# EAGLE design BengalaV1 (EAGLE 9.6.2)
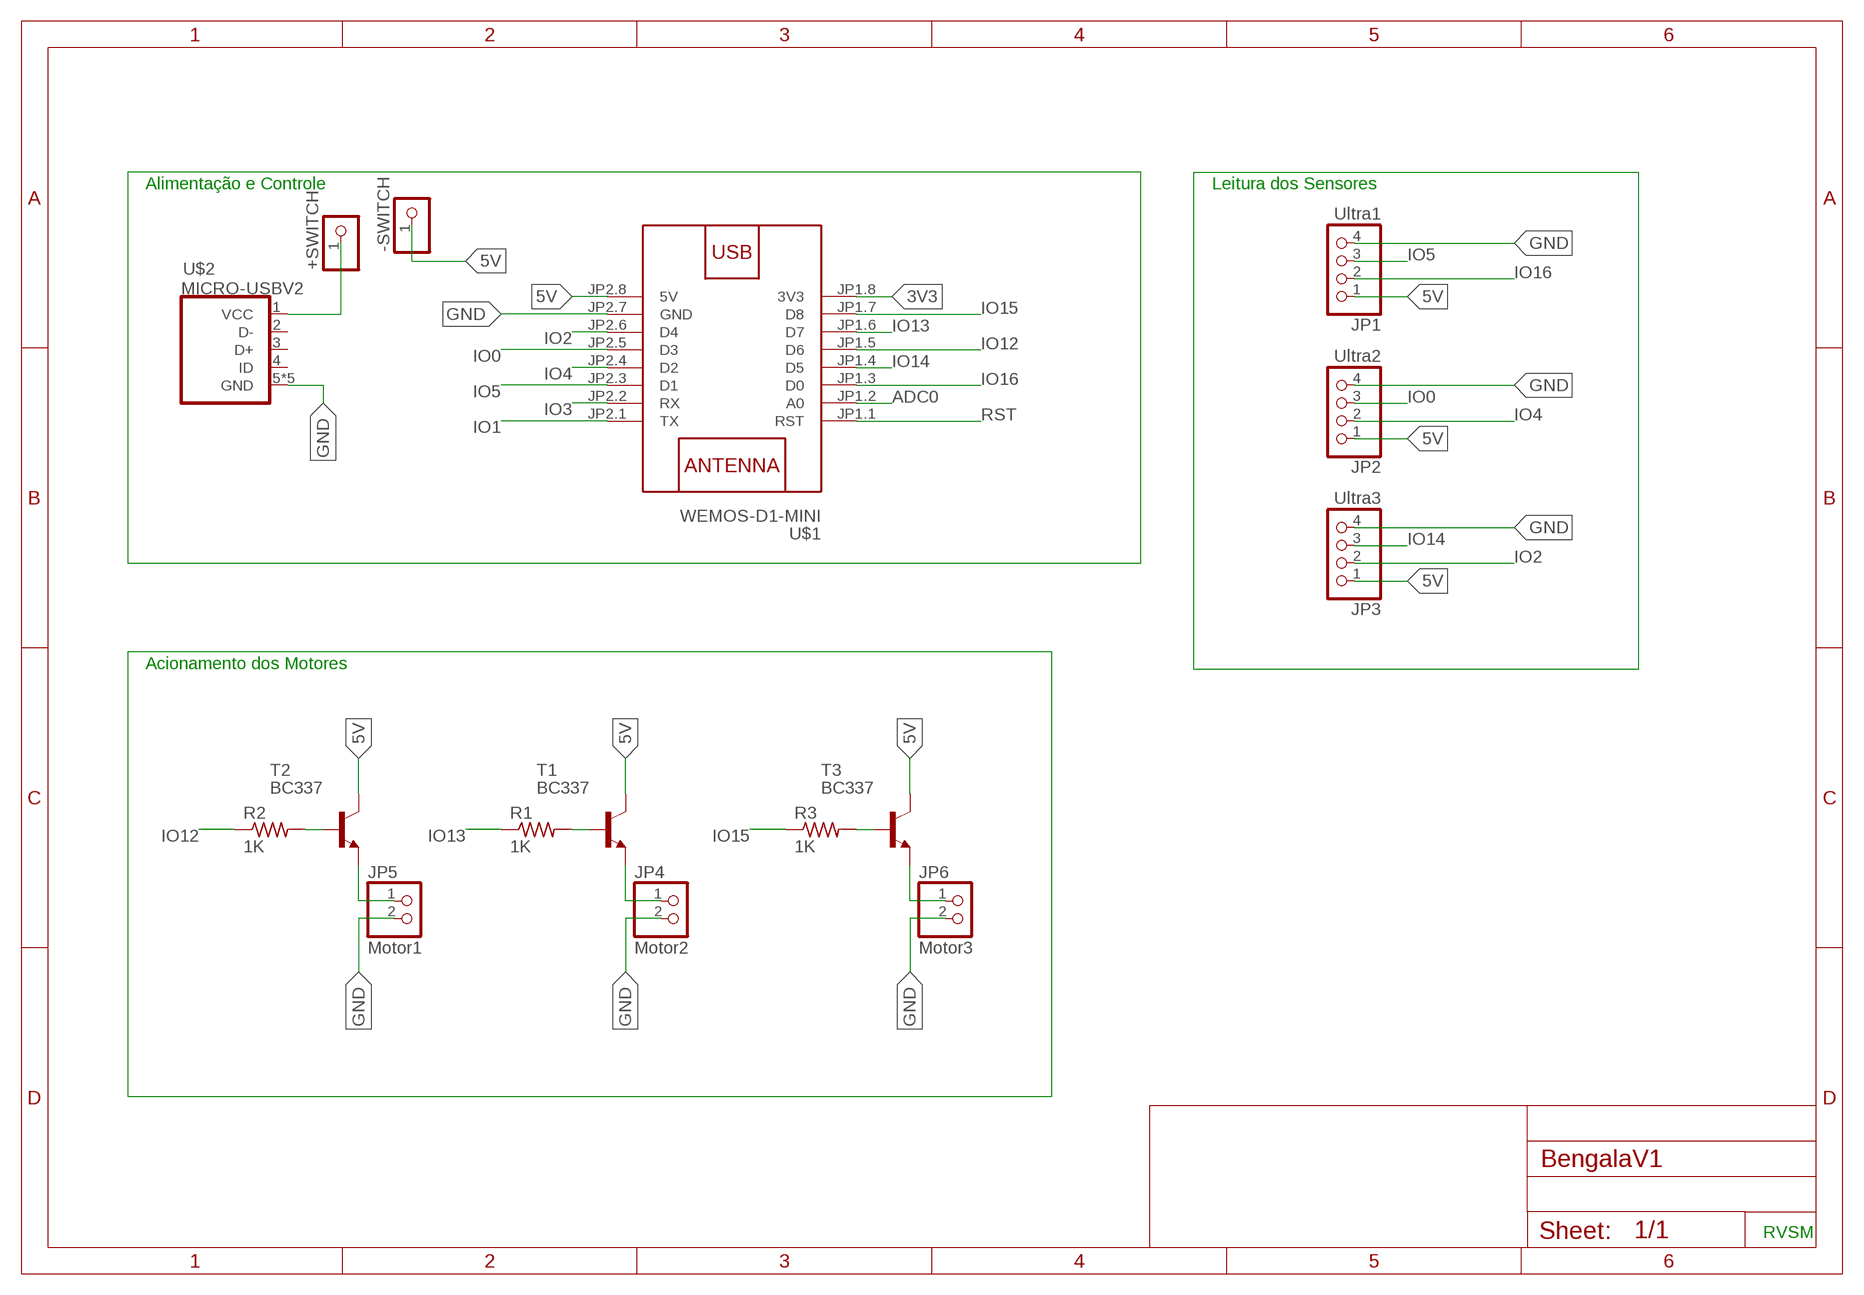
[diagram p0: schematic, sheet 1]

## Parts
+SWITCH  PINHD-1X1  [1X01]
-SWITCH  PINHD-1X1  [1X01]
JP1  Ultra1  PINHD-1X4  [1X04]
JP2  Ultra2  PINHD-1X4  [1X04]
JP3  Ultra3  PINHD-1X4  [1X04]
JP4  Motor2  PINHD-1X2  [1X02]
JP5  Motor1  PINHD-1X2  [1X02]
JP6  Motor3  PINHD-1X2  [1X02]
R1  1K  R-US_0204/7  [0204/7]
R2  1K  R-US_0204/7  [0204/7]
R3  1K  R-US_0204/7  [0204/7]
T1  BC337  [TO92]
T2  BC337  [TO92]
T3  BC337  [TO92]
U$1  WEMOS-D1-MINI  [WEMOS-D1-MINI]
U$2  MICRO-USBV2  [MICRO-USB-2]

## Nets
3V3: U$1.JP1.8(3V3)
5V: -SWITCH.1 JP1.1 JP2.1 JP3.1 T1.3(C) T2.3(C) T3.3(C) U$1.JP2.8(5V)
ADC0: U$1.JP1.2(A0)
GND: JP1.4 JP2.4 JP3.4 JP4.2 JP5.2 JP6.2 U$1.JP2.7(GND) U$2.5(GND) U$2.P$1(GND) U$2.P$2(GND) U$2.P$3(GND) U$2.P$4(GND)
IO0: JP2.3 U$1.JP2.5(D3)
IO1: U$1.JP2.1(TX)
IO2: JP3.2 U$1.JP2.6(D4)
IO3: U$1.JP2.2(RX)
IO4: JP2.2 U$1.JP2.4(D2)
IO5: JP1.3 U$1.JP2.3(D1)
IO12: R2.1 U$1.JP1.5(D6)
IO13: R1.1 U$1.JP1.6(D7)
IO14: JP3.3 U$1.JP1.4(D5)
IO15: R3.1 U$1.JP1.7(D8)
IO16: JP1.2 U$1.JP1.3(D0)
N$1: R1.2 T1.2(B)
N$2: +SWITCH.1 U$2.1(VCC)
N$3: JP4.1 T1.1(E)
N$5: R2.2 T2.2(B)
N$8: JP5.1 T2.1(E)
N$9: R3.2 T3.2(B)
N$10: JP6.1 T3.1(E)
RST: U$1.JP1.1(RST)
Unconnected: U$2.2(D-) U$2.3(D+) U$2.4(ID)

## Notes on the sheet
- Alimentação e Controle | Leitura dos Sensores
- Acionamento dos Motores
- RVSM

## Library data of the parts
+SWITCH -SWITCH = pinhead:PINHD-1X1: PIN HEADER
JP1-JP3 = pinhead:PINHD-1X4: PIN HEADER
JP4-JP6 = pinhead:PINHD-1X2: PIN HEADER
R1-R3 = rcl:R-US_: RESISTOR, American symbol; SPICEPREFIX: R
T1-T3 = transistor:BC337: NPN TRANSISTOR
U$1 = diy-modules:WEMOS-D1-MINI: WEMOS D1 mini: Mini Wi-Fi Board based on ESP-8266 device More details can be found here: https://www.wemos.cc/product/d1-mini.html Click here to find device on ebay.com <http://www.ebay.com/sch/wemos+d1+mini+nodemcu>
U$2 = microusb:MICRO-USB: Micro USB B connector

## Net classes
0 default: width 0.508 mm, drill 0.254 mm

## Board
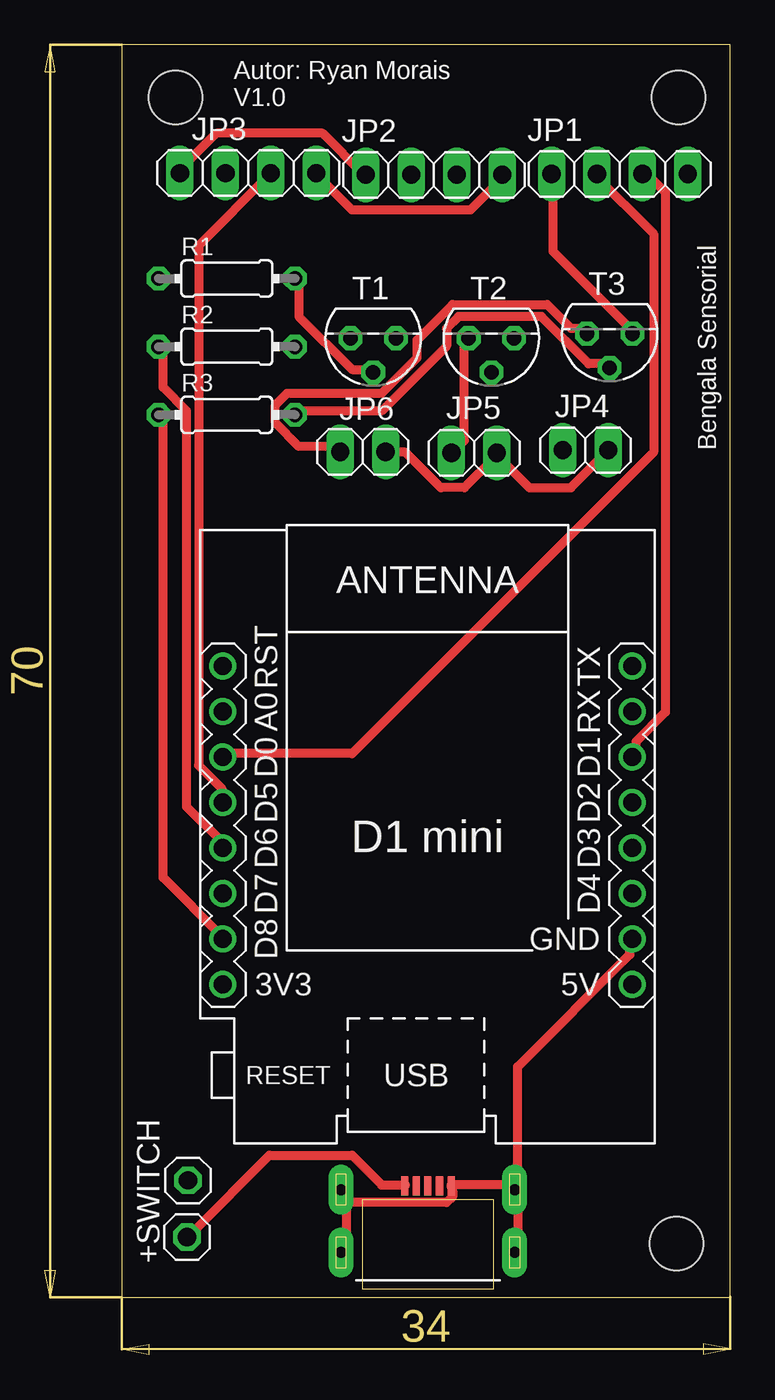
[diagram p1: board, top side]
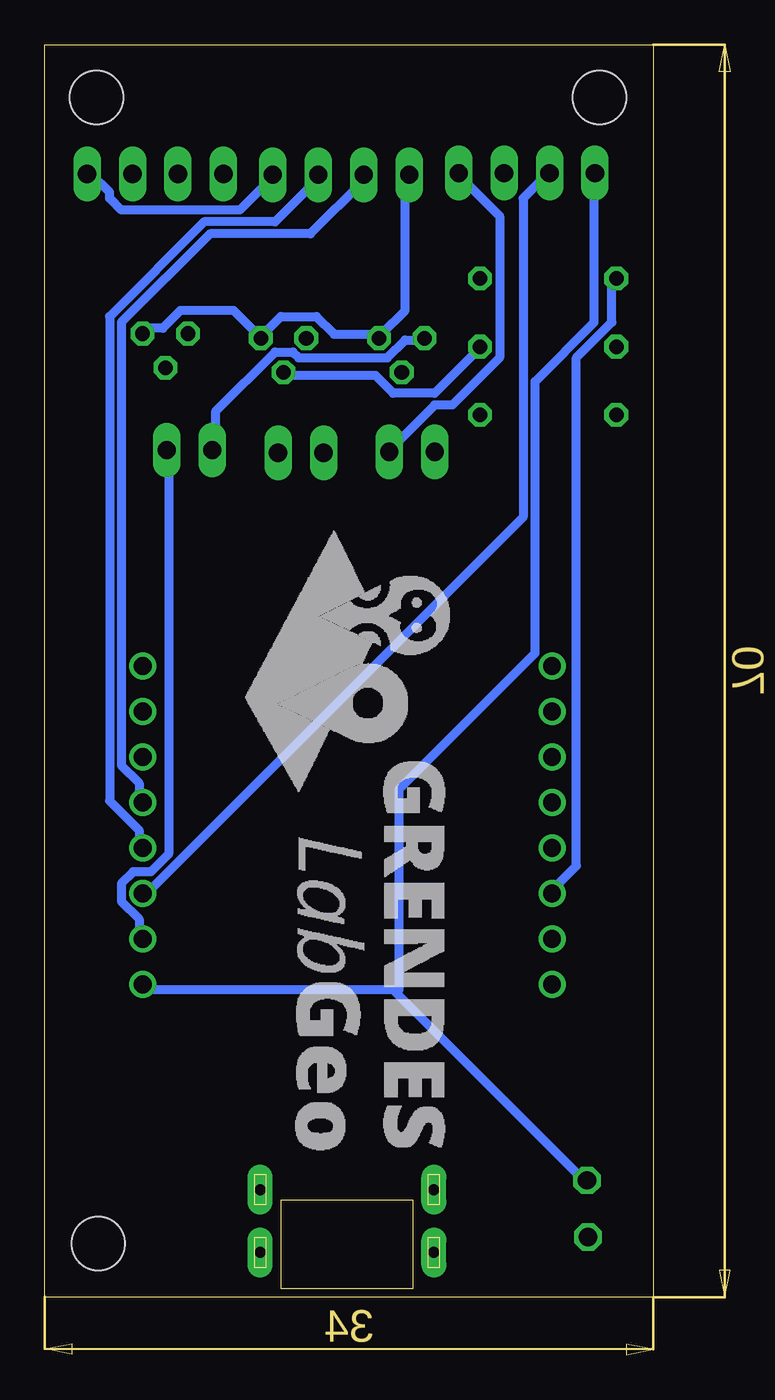
[diagram p2: board, bottom side, seen from below]

Size 34 x 70 mm. Coordinates in mm from the lower left corner, seen from the top.
Outline: 0,0 34,0 34,70 0,70 0,0
Copper layers (1*16): Top 0.035mm / dielectric 1.5mm / Bottom 0.035mm
Design rules "default": minimum track width 6mil, minimum drill 0.35mm, track to track 6mil, track to pad 6mil, pad to pad 6mil, via to via 6mil, smd to smd 6mil, copper to edge 40mil, drill to drill 6mil, minimum pad ring 10mil, minimum via ring 8mil, stop-mask expansion 4mil, vias tented up to drill 0mil, thermal gap 10mil
Holes 3 mm at 3,67.05 31.1,67.05 31.01,2.99

### Footprints (pad centres in the part's own frame; a part is rotated, then mirrored left to right if it is on the bottom)
1X01 = drill 1.016 octagon: 1 0,0
1X04 = drill 1.016 long: 1 -3.81,0; 2 -1.27,0; 3 1.27,0; 4 3.81,0
1X02 = drill 1.016 long: 1 -1.27,0; 2 1.27,0
0204/7 = drill 0.813 octagon: 1 -3.81,0; 2 3.81,0
TO92 = drill 0.813 octagon: 1 1.27,0; 2 0,1.905; 3 -1.27,0
WEMOS-D1-MINI = drill 1: JP1.1 -11.43,9.525; JP1.2 -11.43,6.985; JP1.3 -11.43,4.445; JP1.4 -11.43,1.905; JP1.5 -11.43,-0.635; JP1.6 -11.43,-3.175; JP1.7 -11.43,-5.715; JP1.8 -11.43,-8.255; JP2.1 11.43,9.525; JP2.2 11.43,6.985; JP2.3 11.43,4.445; JP2.4 11.43,1.905; JP2.5 11.43,-0.635; JP2.6 11.43,-3.175; JP2.7 11.43,-5.715; JP2.8 11.43,-8.255
MICRO-USB-2 = smd 0.4 x 1.05: 1 -1.3,5.275; 2 -0.65,5.275; 3 0,5.275; 4 0.65,5.275; 5 1.3,5.275 | drill 0.6 pad 1.4 long: P$1 -4.85,5.05; P$2 -4.85,1.55; P$3 4.85,5.05; P$4 4.85,1.55

### Placement (x,y rotation side)
+SWITCH  3.65,3.35 90 top
-SWITCH  3.7,6.52 90 top
JP1  27.83,62.78 0 top
JP2  17.45,62.73 0 top
JP3  7.07,62.83 0 top
JP4  25.91,47.34 0 top
JP5  19.69,47.19 0 top
JP6  13.47,47.24 0 top
R1  5.87,56.93 0 top
R2  5.87,53.12 0 top
R3  5.87,49.31 0 top
T1  14.05,53.6 180 top
T2  20.66,53.6 180 top
T3  27.26,53.85 180 top
U$1  17.09,25.74 0 top
U$2  17.11,0.95 0 top

### Tracks (layer width: path | path; a pad name or v marks a point on that pad's centre or on a via)
5V
  Top 0.508: JP1.1 24.11,62.74 24.11,58.45 28.4,54.15 T3.3 | JP3.1 3.3,63.07 5.28,65.05 11.23,65.05 13.54,62.74 JP2.1
  Bottom 0.508: T3.3 28.4,54.15 27.41,54.15 26.42,55.14 23.44,55.14 22.12,53.82 T2.3 21.79,53.82 20.8,54.81 18.82,54.81 17.83,53.82 15.52,53.82 T1.3 15.19,53.82 13.87,55.14 13.87,62.41 JP2.1 | 14.36,17 3.96,6.6 -SWITCH.1 | 14.36,17 14.53,17.17 28.4,17.17 U$1.JP2.8 | JP3.1 3.3,62.74 3.3,54.48 6.6,51.18 6.6,35.99 14.2,28.4 14.2,17.17 14.36,17
GND
  Top 0.508: 12.55,5.28 12.55,5.94 U$2.P$1 12.55,5.28 | 12.55,5.28 12.55,2.64 U$2.P$2 | U$2.P$3 21.79,6.27 18.49,6.27 U$2.5 18.49,5.94 18.49,5.61 18.16,5.28 12.55,5.28 | U$2.P$4 22.12,2.64 22.12,5.94 U$2.P$3 | U$1.JP2.7 28.4,19.81 28.4,19.15 22.12,12.88 22.12,6.27 U$2.P$3 | JP6.2 14.86,47.22 15.85,47.22 17.83,45.24 19.15,45.24 20.8,46.89 JP5.2 21.13,46.89 22.78,45.24 25.09,45.24 27.08,47.22 JP4.2 | JP3.4 10.9,62.74 12.88,60.76 19.48,60.76 21.13,62.41 JP2.4
  Bottom 0.508: JP1.4 31.37,62.74 30.38,61.75 30.38,61.42 29.72,60.76 23.11,60.76 21.46,62.41 JP2.4 | JP6.2 14.53,47.55 12.22,49.86 11.23,49.86 8.59,52.5 8.59,60.43 10.9,62.74 JP3.4 | U$1.JP2.7 28.73,20.14 28.73,21.13 29.72,22.12 29.72,23.11 29.06,23.77 28.07,23.77 27.08,24.77 27.08,47.22 JP4.2
IO0
  Bottom 0.508: U$1.JP2.5 28.73,25.43 28.73,26.09 30.38,27.74 30.38,54.81 25.09,60.1 21.13,60.1 18.82,62.41 JP2.3
IO2
  Bottom 0.508: U$1.JP2.6 28.4,22.78 28.07,22.78 7.26,43.59 7.26,61.42 5.94,62.74 JP3.2
IO4
  Bottom 0.508: U$1.JP2.4 28.73,27.74 28.73,28.73 29.72,29.72 29.72,54.48 24.77,59.44 19.15,59.44 16.18,62.41 JP2.2
IO5
  Top 0.508: U$1.JP2.3 28.73,30.38 28.73,31.04 30.38,32.69 30.38,61.75 29.39,62.74 JP1.3
IO12
  Top 0.508: R2.1 2.31,52.83 2.31,50.85 3.63,49.53 3.63,27.41 5.61,25.43 U$1.JP1.5
IO13
  Bottom 0.508: R1.1 2.31,56.79 2.31,54.48 4.29,52.5 4.29,24.11 5.61,22.78 U$1.JP1.6
IO14
  Top 0.508: U$1.JP1.4 5.61,27.74 5.61,28.4 4.29,29.72 4.29,58.78 8.26,62.74 JP3.3
IO15
  Top 0.508: R3.1 2.31,49.2 2.31,23.44 5.61,20.14 U$1.JP1.7
IO16
  Top 0.508: U$1.JP1.3 5.94,30.38 12.88,30.38 29.72,47.22 29.72,59.44 26.42,62.74 JP1.2
N$1
  Top 0.508: T1.2 13.87,51.84 12.88,51.84 9.91,54.81 9.91,56.79 R1.2
N$2
  Top 0.508: U$2.1 15.85,6.27 14.53,6.27 12.88,7.92 8.26,7.92 3.96,3.63 +SWITCH.1
N$3
  Bottom 0.508: T1.1 12.88,53.49 13.87,53.49 14.86,52.5 19.81,52.5 20.14,52.83 21.13,52.83 24.43,49.53 24.43,47.55 JP4.1
N$5
  Bottom 0.508: T2.2 20.47,51.51 15.52,51.51 14.53,50.52 12.22,50.52 9.91,52.83 R2.2
N$8
  Top 0.508: T2.1 19.15,53.49 19.15,47.88 18.49,47.22 JP5.1
N$9
  Top 0.508: R3.2 9.91,49.53 14.53,49.53 18.16,53.16 18.16,54.15 18.82,54.81 23.44,54.81 26.09,52.17 27.08,52.17 T3.2
N$10
  Top 0.508: T3.1 25.76,54.15 25.09,54.15 23.77,55.47 18.49,55.47 16.51,53.49 16.51,52.5 14.53,50.52 9.25,50.52 8.59,49.86 8.59,48.87 9.91,47.55 11.89,47.55 JP6.1

### Text on the board
tNames: Autor: Ryan Morais / V1.0 | Bengala Sensorial